# Altium project PRJ_T3.PrjPCB
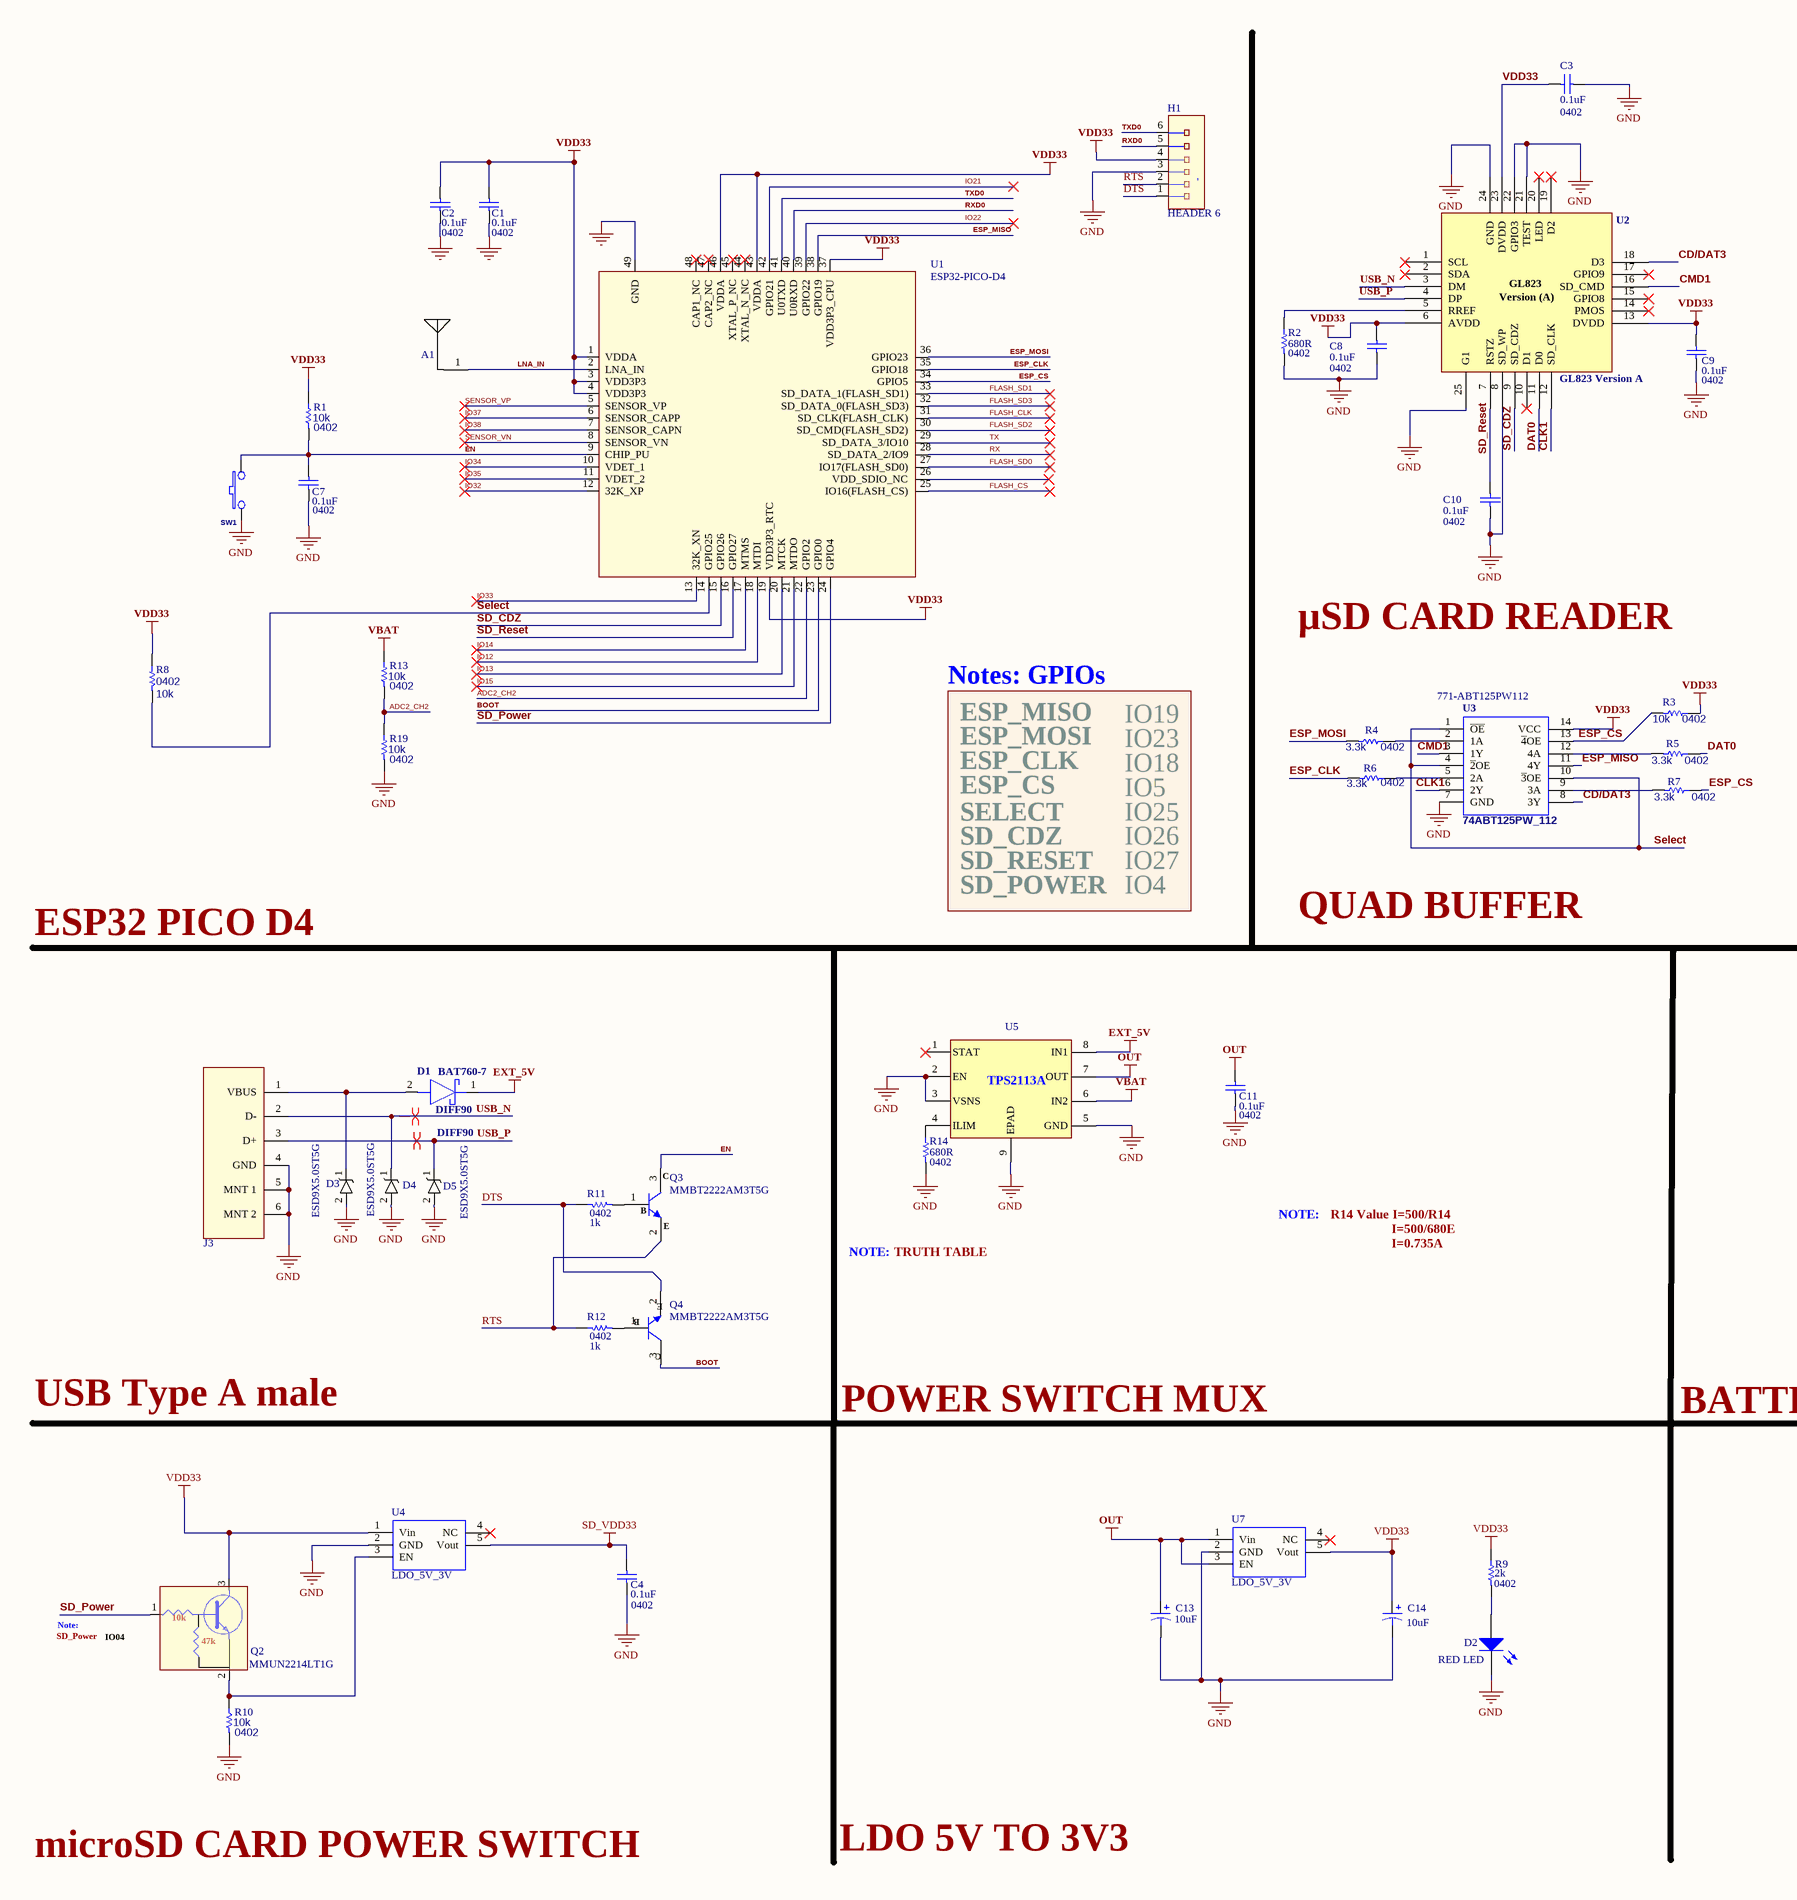
[diagram p0: PICO_D4_SD_CARD_T3.SchDoc, left]
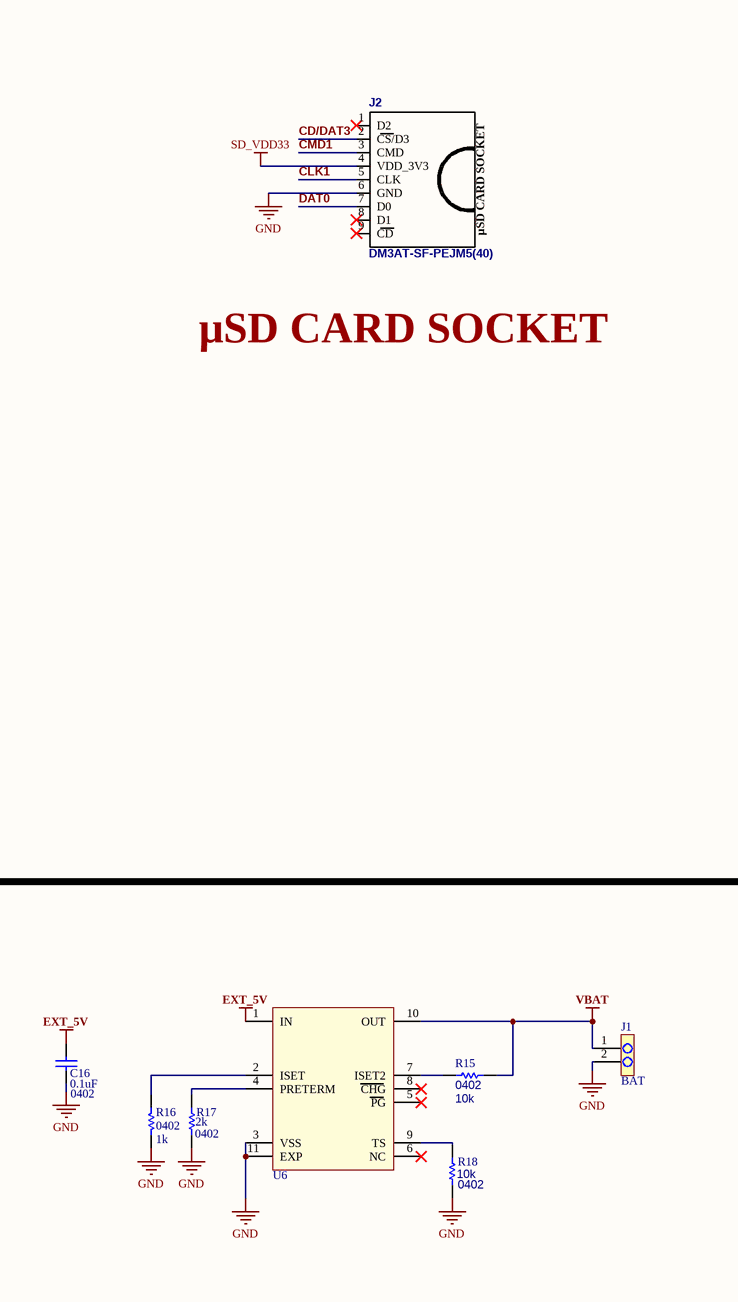
[diagram p1: PICO_D4_SD_CARD_T3.SchDoc, right]
1 sheet, 52 parts. Net scope: global (net labels, ports and power ports of the same name join across sheets).
Board files: PIC0_D4_SD_card_T3.PcbDoc, PCB_PANEL.PcbDoc

## Sheet PICO_D4_SD_CARD_T3.SchDoc
size OrCAD C

### Parts
A1  Ant  [ANT_2450AT43B100E]  (value not drawn)
C1  Case/Package: 0402  [CAPC0402]  (hidden comment: 0.1uF)
C2  Case/Package: 0402  [CAPC0402]  (hidden comment: 0.1uF)
C3  Case/Package: 0402  [CAPC0402]  (hidden comment: 0.1uF)
C4  Case/Package: 0402  [CAPC0402]  (hidden comment: 0.1uF)
C7  Case/Package: 0402  [CAPC0402]  (hidden comment: 0.1uF)
C8  Case/Package: 0402  [CAPC0402]  (hidden comment: 0.1uF)
C9  Case/Package: 0402  [CAPC0402]  (hidden comment: 0.1uF)
C10  Case/Package: 0402  [CAPC0402]  (hidden comment: 0.1uF)
C11  Case/Package: 0402  [CAPC0402]  (hidden comment: 0.1uF)
C13  10uF  [CAPC0603]
C14  10uF  [CAPC0603]
C16  Case/Package: 0402  [CAPC0402]  (hidden comment: 0.1uF)
D1  BAT760-7  [SOD2513X120N]
D2  RED LED  [LED_0603]
D3  ESD9X5.0ST5G  [SOD-923]
D4  ESD9X5.0ST5G  [SOD-923]
D5  ESD9X5.0ST5G  [SOD-923]
H1  HEADER 6  [HEADER_2MM]
J1  BAT  [HDR1X2H - duplicate]  (no BOM)
J2  DM3AT-SF-PEJM5(40)  [sd card connector]
J3  USB MALE  [Molex_48037-0001_0]  (value not drawn)
Q2  Manufacturer Part Number: MMUN2214LT1G  [SOT95P240X115-3N]  (hidden comment: Transistor NPN)
Q3  MMBT2222AM3T5G  [SOT-723]
Q4  MMBT2222AM3T5G  [SOT-723]
R1  value 10k  Case/Package: 0402  [resc0402]  (hidden comment: Res1)
R2  value 680R  Case/Package: 0402  [resc0402]
R3  value 10k  Case/Package: 0402  [resc0402]  (hidden comment: Res1)
R4  value 3.3k  Case/Package: 0402  [RESC0402]  (hidden comment: Res1)
R5  value 3.3k  Case/Package: 0402  [RESC0402]
R6  value 3.3k  Case/Package: 0402  [RESC0402]
R7  value 3.3k  Case/Package: 0402  [RESC0402]
R8  value 10k  Case/Package: 0402  [resc0402]  (hidden comment: Res1)
R9  value 2k  Case/Package: 0402  [resc0402]  (hidden comment: Res1)
R10  value 10k  Case/Package: 0402  [resc0402]  (hidden comment: Res1)
R11  value 1k  Case/Package: 0402  [resc0402]  (hidden comment: Res1)
R12  value 1k  Case/Package: 0402  [resc0402]  (hidden comment: Res1)
R13  value 10k  Case/Package: 0402  [resc0402]  (hidden comment: Res1)
R14  value 680R  Case/Package: 0402  [resc0402]
R15  value 10k  Case/Package: 0402  [resc0402]  (hidden comment: Res1)
R16  value 1k  Case/Package: 0402  [resc0402]  (hidden comment: Res1)
R17  value 2k  Case/Package: 0402  [resc0402]  (hidden comment: Res1)
R18  value 10k  Case/Package: 0402  [resc0402]  (hidden comment: Res1)
R19  value 10k  Case/Package: 0402  [resc0402]  (hidden comment: Res1)
SW1  SW PUSHBUTTON  [Micro_push]  (value not drawn)
U1  ESP32-PICO-D4  [ESP32_PICO_D4_2]
U2  GL823 Version A  [QFN24-4x4MM]
U3  74ABT125PW_112  Supplier Part Number 1: 771-ABT125PW112  [74ABT125PW]
U4  LDO_5V_3V  [SOT25]
U5  TPS2113ADRBR  [SON-8]  (value not drawn)
U6  BQ24040DSQR  [10-WFDFN]  (value not drawn)
U7  LDO_5V_3V  [SOT25]

### Nets
EXT_5V: C16.2 D1.1(K) U5.8(IN1) U6.1(IN)
GND: C1.2 C2.2 C3.1 C4.2 C7.1 C8.1 C9.1 C10.1 C11.1 C13.2 C14.2 C16.1 D2.2(K) D3.2(A) D4.2(A) D5.2(A) H1.3 J1.2 J2.6(GND) J3.4(GND) J3.5(MNT_1) J3.6(MNT_2) R2.2 R10.2 R14.2 R16.1 R17.2 R18.2 R19.2 SW1.1 U1.49(GND) U2.8(SD_WP) U2.21(TEST) U2.22(GPIO3) U2.24(GND) U2.25(G1) U3.7(GND) U4.2(GND) U5.2(EN) U5.3(VSNS) U5.5(GND) U5.9(EPAD) U6.3(VSS) U6.11(EXP) U7.2(GND)
OUT: C11.2 C13.1 U5.7(OUT) U7.1(Vin) U7.3(EN)
SD_VDD33: C4.1 J2.4(VDD_3V3) U4.5(Vout)
VBAT: J1.1 R13.1 R15.2 U5.6(IN2) U6.10(OUT)
VDD33: C1.1 C2.1 C3.2 C8.2 C9.2 C14.1 H1.4 Q2.3(C) R1.1 R3.1 R8.1 R9.1 U1.1(VDDA) U1.3(VDD3P3) U1.4(VDD3P3) U1.19(VDD3P3_RTC) U1.37(VDD3P3_CPU) U1.43(VDDA) U1.46(VDDA) U2.6(AVDD) U2.13(DVDD) U2.23(DVDD) U3.14(VCC) U4.1(Vin) U7.5(Vout)
ADC2_CH2: R13.2 R19.1 U1.22(GPIO2)
BOOT: Q4.3(C) U1.23(GPIO0)
CD/DAT3: J2.2(CS/D3) U2.18(D3) U3.8(3Y)
CLK1: J2.5(CLK) U2.12(SD_CLK) U3.6(2Y)
CMD1: J2.3(CMD) U2.16(SD_CMD) U3.3(1Y)
DAT0: J2.7(D0) R5.1 U2.11(D0)
DTS: H1.1 Q4.2(E) R11.1
EN: C7.2 Q3.3(C) R1.2 SW1.2 U1.9(CHIP_PU)
ESP_CLK: R6.2 U1.35(GPIO18)
ESP_CS: R3.2 R7.1 U1.34(GPIO5) U3.13(~{4}OE)
ESP_MISO: U1.38(GPIO19) U3.11(4Y)
ESP_MOSI: R4.2 U1.36(GPIO23)
FLASH_CLK: U1.31(SD_CLK(FLASH_CLK))
FLASH_CS: U1.25(IO16(FLASH_CS))
FLASH_SD0: U1.27(IO17(FLASH_SD0))
FLASH_SD1: U1.33(SD_DATA_1(FLASH_SD1))
FLASH_SD2: U1.30(SD_CMD(FLASH_SD2))
FLASH_SD3: U1.32(SD_DATA_0(FLASH_SD3))
IO12: U1.18(MTDI)
IO13: U1.20(MTCK)
IO14: U1.17(MTMS)
IO15: U1.21(MTDO)
IO21: U1.42(GPIO21)
IO22: U1.39(GPIO22)
IO32: U1.12(32K_XP)
IO33: U1.13(32K_XN)
IO34: U1.10(VDET_1)
IO35: U1.11(VDET_2)
IO37: U1.6(SENSOR_CAPP)
IO38: U1.7(SENSOR_CAPN)
LNA_IN: A1.1(Ant) U1.2(LNA_IN)
RTS: H1.2 Q3.2(E) R12.1
RX: U1.28(SD_DATA_2/IO9)
RXD0: H1.5 U1.40(U0RXD)
SD_CDZ: U1.15(GPIO26) U2.9(SD_CDZ)
SD_Power: Q2.1(B) U1.24(GPIO4)
SD_Reset: C10.2 U1.16(GPIO27) U2.7(RSTZ)
Select: R8.2 U1.14(GPIO25) U3.1(~{OE}) U3.4(~{2}OE) U3.10(~{3}OE)
SENSOR_VN: U1.8(SENSOR_VN)
SENSOR_VP: U1.5(SENSOR_VP)
TX: U1.29(SD_DATA_3/IO10)
TXD0: H1.6 U1.41(U0TXD)
USB_N: D4.1(K) J3.2(D-) U2.3(DM)
USB_P: D5.1(K) J3.3(D+) U2.4(DP)
NetD1_2: D1.2(A) D3.1(K) J3.1(VBUS)
NetD2_1: D2.1(A) R9.2
NetQ2_2: Q2.2(E) R10.1 U4.3(EN)
NetQ3_1: Q3.1(B) R11.2
NetQ4_1: Q4.1(B) R12.2
NetR2_1: R2.1 U2.5(RREF)
NetR4_1: R4.1 U3.2(1A)
NetR5_2: R5.2 U3.12(4A)
NetR6_1: R6.1 U3.5(2A)
NetR7_2: R7.2 U3.9(3A)
NetR14_1: R14.1 U5.4(ILIM)
NetR15_1: R15.1 U6.7(ISET2)
NetR16_2: R16.2 U6.2(ISET)
NetR17_1: R17.1 U6.4(PRETERM)
NetR18_1: R18.1 U6.9(TS)

Not connected (* = marked no-connect by the designer): J2 1(D2)* 8(D1)* 9(CD)*; U1 26(VDD_SDIO_NC)* 44(XTAL_N_NC)* 45(XTAL_P_NC)* 47(CAP2_NC)* 48(CAP1_NC)*; U2 1(SCL)* 2(SDA)* 10(D1)* 14(PMOS)* 15(GPIO8)* 17(GPIO9)* 19(D2)* 20(LED)*; U4 4(NC)*; U5 1(STAT)*; U6 5(PG)* 6(NC)* 8(CHG)*; U7 4(NC)*

### Layout directives
differential pair; net class DIFF90: USB_N, USB_P

### Notes on the sheet
- μSD CARD SOCKET
- μSD CARD READER
- Notes: GPIOs
- ESP_MISO
- ESP_MOSI
- IO19
- IO23
- ESP_CLK
- ESP_CS
- SELECT
- IO18
- IO5
- IO25
- SD_CDZ
- SD_RESET
- IO26
- IO27
- ESP32 PICO D4
- SD_POWER
- IO4
- QUAD BUFFER
- NOTE:
- R14 Value I=500/R14
- I=500/680E
- I=0.735A
- TRUTH TABLE
- USB Type A male
- POWER SWITCH MUX
- BATTERY CHARGER
- SD_Power
- Note:
- (near Q2) IO04
- microSD CARD POWER SWITCH
- LDO 5V TO 3V3
- (in symbol DM3AT-SF-PEJM5(40)) μSD CARD SOCKET
- (in symbol GL823) Version (A)
- (in symbol TPS2113ADRBR) TPS2113A
- (in symbol Transistor NPN) 10k; 47k

### Library data of the parts
A1 = Ant: High Frequency Ceramic Solutions 4-Pin SMD T/R; Manufacturer: Johanson; Manufacturer Part Number: 2450AT43B100E; Gain: -0.5dB; Impedance: 50R; Power Rating: 2W; Number of Bands: 1; Return Loss: -9.5dB; Frequency: 2.4GHz; Max Frequency: 2.5GHz; Supplier 1: Digi-Key; Supplier Part Number 1: 712-1010-1-ND; RoHS: Yes; Category: RF Antennas; Stock 1: 63050; Pricing 1: 1=0.71000, 10=0.62400, 25=0.58600, 100=0.47820, 250=0.44416, 500=0.37800 (USD); Mount: Surface Mount; Case/Package: SMD/SMT; Number of Pins: 4; Contact Plating: Tin; Package Quantity: 1; Packaging: Tape and Reel; Max Power Dissipation: 2W; Termination: Solder; Length: 7mm; Height: 0.079inch; Width: 2mm; Radiation Hardening: No; REACH SVHC: Unknown; ComponentLink1URL: https://datasheet.ciiva.com/24068/2450at43b100-242468-24068034.pdf?src-supplier=Mouser; ComponentLink1Description: https://datasheet.ciiva.com/24068/2450at43b100-242468-24068034.pdf?src-supplier=Mouser; ComponentLink2URL: https://datasheet.ciiva.com/2792/jti-antenna-2450at43b100-09042008-2792593.pdf?src-supplier=Digi-Key; ComponentLink2Description: https://datasheet.ciiva.com/2792/jti-antenna-2450at43b100-09042008-2792593.pdf?src-supplier=Digi-Key; ComponentLink3URL: https://datasheet.ciiva.com/7633/1860765-7633973.pdf?src-supplier=Element14; ComponentLink3Description: https://datasheet.ciiva.com/7633/1860765-7633973.pdf?src-supplier=Element14
C1-C4 C7-C11 C16 = Cap: Ceramic Capacitor,100nF,16V,0402; Mfr.: C0805C104K1RECAUTO; Manufacturer: TDK; Manufacturer Part Number: C1608X7R1C104K; Tolerance: 10%; Dielectric: X7R; Value: 0.1uF; Supplier 1: Digi-Key; Supplier Part Number 1: 445-1317-6-ND; Stock 1: 0; Mount: Surface Mount; Number of Pins: 2; Dielectric Material: Ceramic; Case Code (Imperial): 0402; Case Code (Metric): 1608; Min Operating Temperature: -55°C; Max Operating Temperature: 125°C; Capacitance: 100nF; Voltage Rating (DC): 16V; Packaging: Tape and Reel; Package Quantity: 1; Voltage Rating: 16V; Termination: SMD/SMT; Composition: Ceramic; Length: 1.6mm; Height: 0.8mm; Width: 0.8mm; Thickness: 0.037inch; Depth: 0.8mm; Radiation Hardening: No; Lead Free: Lead Free; ComponentLink1URL: https://media.digikey.com/pdf/Data%20Sheets/TDK%20PDFs/C_Series_GeneralAppl_Spec_rev_0.3_201012.pdf?src-supplier=Digi-Key; ComponentLink1Description: https://media.digikey.com/pdf/Data%20Sheets/TDK%20PDFs/C_Series_GeneralAppl_Spec_rev_0.3_201012.pdf?src-supplier=Digi-Key; ComponentLink2URL: https://media.digikey.com/pdf/Data%20Sheets/TDK%20PDFs/C_Series_GeneralAppl_B11.pdf?src-supplier=Digi-Key; ComponentLink2Description: https://media.digikey.com/pdf/Data%20Sheets/TDK%20PDFs/C_Series_GeneralAppl_B11.pdf?src-supplier=Digi-Key; ComponentLink3URL: https://www.verical.com/server-webapp/html/getDatasheet?partID=169336&src-supplier=Verical; ComponentLink3Description: https://www.verical.com/server-webapp/html/getDatasheet?partID=169336&src-supplier=Verical; ComponentLink4URL: http://www.tdk.co.jp/tefe02/e412_c.pdf?src-supplier=Future+Electronics; ComponentLink4Description: http://www.tdk.co.jp/tefe02/e412_c.pdf?src-supplier=Future+Electronics; ComponentLink5URL: http://www.farnell.com/datasheets/1571323.pdf?src-supplier=Element14; ComponentLink5Description: http://www.farnell.com/datasheets/1571323.pdf?src-supplier=Element14
C13 C14 = Cap Pol2: Ceramic Capacitor,10uF,16V,0603; Mfr. No: 0603C106KAT2A; Value: 10uF; Case/Package: 0603
D1 = BAT760-7: Schottky Diodes & Rectifiers 1A 30V LF1A, 2-Pin SOD-323; Manufacturer Part Number: BAT760-7; Case/Package: SOD-323
D2 = LED1: LED, RED,SMD, 0603; Case/Package: 0603; Manufacturer Part Number: LED, RED,SMD, 0603
D3-D5 = ESD9X5.0ST5G: 12.3V Clamp 8.7A (8/20µs) Ipp Tvs Diode Surface Mount SOD-923; Manufacturer: ON Semiconductor; Direction: Unidirectional; Number of Elements: 1; Capacitance: 65pF; Operating Supply Voltage: 5V; Reverse Breakdown Voltage: 6.2V; Peak Pulse Power: 107W; Power Line Protection: No; ESD Protection: Yes; Test Current: 1mA; Max Reverse Leakage Current: 1uA; Max Power Dissipation: 150mW; Element Configuration: Single; Supplier 1: Digi-Key; RoHS: Yes; Category: ESD and Circuit Protection ICs; Stock 1: 835133; Pricing 1: 1=0.14000, 10=0.12700, 25=0.12120, 100=0.05340, 250=0.05120, 500=0.04190, 1000=0.02910, 2500=0.02542 (USD); Case/Package: SOD-923-2; Number of Pins: 2; Contact Plating: Tin,Matte; Min Operating Temperature: -55°C; Max Operating Temperature: 150°C; Packaging: Tape and Reel; Package Quantity: 1; Max Surge Current: 8.7A; Number of Unidirectional Channels: 1; Reverse Standoff Voltage: 5V; Min Breakdown Voltage: 6.2V; Clamping Voltage: 12.3V; Breakdown Voltage: 6.2V; Number of Channels: 1; Polarity: Unidirectional; Termination: SMD/SMT; Working Voltage: 5V; Leakage Current: 1uA; Max Breakdown Voltage: 6.2V; Peak Pulse Current: 8.7A; Number of Lines: 1; Composition: Zener; Length: 0.8mm; Height: 0.4mm; Width: 0.65mm; Depth: 0.6mm; Radiation Hardening: No; Lead Free: Lead Free; REACH SVHC: No SVHC; Halogen Free: Halogen Free; ComponentLink1URL: https://datasheet.ciiva.com/30478/0900766b812769b5-30478676.pdf?src-supplier=RSComponents; ComponentLink1Description: https://datasheet.ciiva.com/30478/0900766b812769b5-30478676.pdf?src-supplier=RSComponents; ComponentLink2URL: https://datasheet.ciiva.com/25958/esd9x3-3st5g-d-25958458.pdf?src-supplier=Avnet+Europe; ComponentLink2Description: https://datasheet.ciiva.com/25958/esd9x3-3st5g-d-25958458.pdf?src-supplier=Avnet+Europe; ComponentLink3URL: https://datasheet.ciiva.com/1219/1748783-1219324.pdf?src-supplier=Newark; ComponentLink3Description: https://datasheet.ciiva.com/1219/1748783-1219324.pdf?src-supplier=Newark; ComponentLink4URL: https://datasheet.ciiva.com/3304/esd9x3-3st5g-d-3304012.pdf?src-supplier=Avnet; ComponentLink4Description: https://datasheet.ciiva.com/3304/esd9x3-3st5g-d-3304012.pdf?src-supplier=Avnet; ComponentLink5URL: https://datasheet.ciiva.com/339/esd9x3-3st5g-d-339709.pdf?src-supplier=Digi-Key; ComponentLink5Description: https://datasheet.ciiva.com/339/esd9x3-3st5g-d-339709.pdf?src-supplier=Digi-Key; ComponentLink6URL: https://datasheet.ciiva.com/16215/esd9x3-3st5g-d-16215149.pdf?src-supplier=Future+Electronics; ComponentLink6Description: https://datasheet.ciiva.com/16215/esd9x3-3st5g-d-16215149.pdf?src-supplier=Future+Electronics; ComponentLink7URL: https://datasheet.ciiva.com/339/esd9x3-3st5g-d-339710.pdf?src-supplier=Digi-Key; ComponentLink7Description: https://datasheet.ciiva.com/339/esd9x3-3st5g-d-339710.pdf?src-supplier=Digi-Key; ComponentLink8URL: https://datasheet.ciiva.com/339/esd9x3-3st5g-d-339711.pdf?src-supplier=Digi-Key; ComponentLink8Description: https://datasheet.ciiva.com/339/esd9x3-3st5g-d-339711.pdf?src-supplier=Digi-Key; Supplier Part Number 1: ESD9X5.0ST5GOSCT-ND; Manufacturer Part Number: ESD9X5.0ST5G
H1 = HEADER 6: Header, 6-Pin,2MM; Manufacturer Part Number: 2mm PITCH; Case/Package: TH
J1 = Header 2 pin
J2 = DM3AT-SF-PEJM5(40): Micro SD Memory Card Socket; Manufacturer_Name: Hirose; Allied_Number: R1050628; RS Part Number: 7079520P; RS Price/Stock: http://uk.rs-online.com/web/p/products/7079520P; Mouser Part Number: 798-DM3AT-SF-PEJM540; Datasheet Link: http://uk.rs-online.com/web/p/products/7079520; Manufacturer Part Number: DM3AT-SF-PEJM5(40); Allied Price/Stock: http://www.alliedelec.com/hirose-electric-dm3at-sf-pejm5-40-/R1050628/; Mouser Price/Stock: https://www.mouser.com/Search/Refine.aspx?Keyword=798-DM3AT-SF-PEJM540
J3 = USB MALE: USB A-type Plug Male PCB R/A; Manufacturer Part Number: USB Type A male; Case/Package: TH
Q2 = Transistor NPN: Bipolar Transistors - Pre-Biased 100mA 50V BRT NPN; Manufacturer: ON Semiconductor; Max Power Dissipation: 246mW; hFE Min: 80; Collector Emitter Saturation Voltage: 250mV; Element Configuration: Single; Supplier 1: Mouser; Stock 1: 56410; Pricing 1: 1=0.12, 10=0.105, 50=0.105, 100=0.037, 1000=0.025, 10000=0.017 (USD); Case/Package: SOT-23-3; Number of Pins: 3; Contact Plating: Tin,Matte; Min Operating Temperature: -55°C; Max Operating Temperature: 150°C; Package Quantity: 1; Collector Emitter Voltage (VCEO): 50V; Packaging: Tape and Reel; Max Collector Current: 100mA; Collector Emitter Breakdown Voltage: 50V; Polarity: NPN; Max Breakdown Voltage: 50V; Max Output Current: 100mA; Operating Supply Voltage: 50V; Continuous Collector Current: 100mA; Power Dissipation: 246mW; Voltage Rating (DC): 50V; Current Rating: 100mA; Length: 2.9mm; Height: 0.94mm; Width: 1.3mm; Radiation Hardening: No; Lead Free: Lead Free; Halogen Free: Halogen Free; REACH SVHC: No SVHC; ComponentLink1URL: http://www.onsemi.ru.com/pub/Collateral/DTC114Y-D.PDF?src-supplier=Avnet+Europe; ComponentLink1Description: http://www.onsemi.ru.com/pub/Collateral/DTC114Y-D.PDF?src-supplier=Avnet+Europe; ComponentLink2URL: https://www.verical.com/server-webapp/html/getDatasheet?partID=38473&src-supplier=Verical; ComponentLink2Description: https://www.verical.com/server-webapp/html/getDatasheet?partID=38473&src-supplier=Verical; ComponentLink3URL: http://www.onsemi.com/pub/Collateral/DTC114Y-D.PDF?src-supplier=Digi-Key; ComponentLink3Description: http://www.onsemi.com/pub/Collateral/DTC114Y-D.PDF?src-supplier=Digi-Key; ComponentLink4URL: http://www.onsemi.com/pub/Collateral/DTC114Y-D.PDF?src-supplier=Future+Electronics; ComponentLink4Description: http://www.onsemi.com/pub/Collateral/DTC114Y-D.PDF?src-supplier=Future+Electronics; Supplier Part Number 1: 863-MMUN2214LT1G
Q3 Q4 = MMBT2222AM3T5G: Bipolar Transistors - BJT SS SOT-723 GP TRANSISTOR NPN; Manufacturer: ON Semiconductor; Max Power Dissipation: 640mW; Collector Emitter Voltage (VCEO): 40V; Max Collector Current: 600mA; Transition Frequency: 300MHz; Collector Base Voltage (VCBO): 75V; Emitter Base Voltage (VEBO): 6V; Number of Elements: 1; Element Configuration: Single; ComponentLink1Description: Manufacturer Link; ComponentLink1URL: http://www.fairchildsemi.com/; ComponentLink2Description: Datasheet; ComponentLink2URL: http://www.fairchildsemi.com/ds/2N%2F2N3904.pdf; Supplier 1: Mouser; Supplier Part Number 1: 863-MMBT2222AM3T5G; Manufacturer Part Number: MMBT2222AM3T5G; Stock 1: 18115; Pricing 1: 1=0.2, 10=0.135, 50=0.135, 100=0.057, 1000=0.039, 2500=0.03, 8000=0.026, 10000=0.026, 24000=0.024, 48000=0.023 (USD); Case/Package: SOT-723-3; Number of Pins: 3; Contact Plating: Tin,Matte; Min Operating Temperature: -55°C; Max Operating Temperature: 150°C; Packaging: Tape and Reel; Collector Emitter Breakdown Voltage: 40V; Max Breakdown Voltage: 40V; Package Quantity: 1; Frequency: 300MHz; Polarity: NPN; Power Dissipation: 640mW; Max Frequency: 300MHz; Gain Bandwidth Product: 300MHz; Radiation Hardening: No; Lead Free: Lead Free; REACH SVHC: No SVHC; ComponentLink3URL: http://www.mouser.com/ds/2/308/MMBT2222AM3-D-107843.pdf?src-supplier=Mouser; ComponentLink3Description: http://www.mouser.com/ds/2/308/MMBT2222AM3-D-107843.pdf?src-supplier=Mouser; ComponentLink4URL: https://4donline.ihs.com/images/VipMasterIC/IC/ONSM/ONSM-S-A0003065668/ONSM-S-A0003065668-1.pdf?hkey=52A5661711E402568146F3353EA87419&src-supplier=Element14; ComponentLink4Description: https://4donline.ihs.com/images/VipMasterIC/IC/ONSM/ONSM-S-A0003065668/ONSM-S-A0003065668-1.pdf?hkey=52A5661711E402568146F3353EA87419&src-supplier=Element14; ComponentLink5URL: http://www.onsemi.com/pub/Collateral/MMBT2222AM3-D.PDF?src-supplier=Avnet; ComponentLink5Description: http://www.onsemi.com/pub/Collateral/MMBT2222AM3-D.PDF?src-supplier=Avnet; ComponentLink6URL: http://www.onsemi.com/pub/Collateral/MMBT2222AM3-D.PDF?src-supplier=Digi-Key; ComponentLink6Description: http://www.onsemi.com/pub/Collateral/MMBT2222AM3-D.PDF?src-supplier=Digi-Key; ComponentLink7URL: https://www.verical.com/server-webapp/html/getDatasheet?partID=185710&src-supplier=Verical; ComponentLink7Description: https://www.verical.com/server-webapp/html/getDatasheet?partID=185710&src-supplier=Verical; ComponentLink8URL: http://www.onsemi.com/pub/Collateral/MMBT2222AM3-D.PDF?src-supplier=Avnet+Europe; ComponentLink8Description: http://www.onsemi.com/pub/Collateral/MMBT2222AM3-D.PDF?src-supplier=Avnet+Europe; ComponentLink9URL: http://www.onsemi.com/pub_link/Collateral/MMBT2222AM3-D.PDF?src-supplier=Future+Electronics; ComponentLink9Description: http://www.onsemi.com/pub_link/Collateral/MMBT2222AM3-D.PDF?src-supplier=Future+Electronics
R1 R3 R8 R10 R13 R15 R18 R19 = Res1: Thick Film Resistor -  10Kohm, 1%, 0402; Manufacturer: Vishay; Manufacturer Part Number: CRCW040210K0FKED; Power Rating: 63mW; Temperature Coefficient: 100ppm/°C; Voltage Rating: 50V; Supplier 1: Mouser; Supplier Part Number 1: 71-CRCW0402-10K-E3; Stock 1: 7743; Pricing 1: 1=0.1, 10=0.042, 50=0.042, 100=0.029, 1000=0.016, 10000=0.011 (USD); Mount: Surface Mount; Number of Pins: 2; Weight: 2.3E-05oz; Contact Plating: Tin; Min Operating Temperature: -55°C; Max Operating Temperature: 155°C; Tolerance: 1%; Composition: Thick Film; Termination: SMD/SMT; Package Quantity: 10; Packaging: Tape and Reel; Number of Terminations: 2; Military Standard: Not; Max Power Dissipation: 63mW; Voltage Rating (DC): 50V; Features: Automotive AEC-Q200; Length: 1mm; Height: 0.35mm; Width: 0.02inch; Depth: 0.5mm; Radiation Hardening: No; Lead Free: Lead Free; REACH SVHC: Unknown; ComponentLink1URL: http://uk.rs-online.com/webdocs/0d98/0900766b80d98824.pdf?src-supplier=RSComponents; ComponentLink1Description: http://uk.rs-online.com/webdocs/0d98/0900766b80d98824.pdf?src-supplier=RSComponents; ComponentLink2URL: http://www.vishay.com/docs/20035/dcrcwe3.pdf?src-supplier=Digi-Key; ComponentLink2Description: http://www.vishay.com/docs/20035/dcrcwe3.pdf?src-supplier=Digi-Key; ComponentLink3URL: http://www.farnell.com/datasheets/2045673.pdf?src-supplier=Element14; ComponentLink3Description: http://www.farnell.com/datasheets/2045673.pdf?src-supplier=Element14; ComponentLink4URL: http://www.vishay.com/docs/20035/dcrcwe3.pdf?src-supplier=Avnet; ComponentLink4Description: http://www.vishay.com/docs/20035/dcrcwe3.pdf?src-supplier=Avnet; ComponentLink5URL: https://www.distrelec.biz/Web/Downloads/a_/en/flD-CRCW-e3_data_en.pdf?mime=application%2Fpdf&src-supplier=Distrelec; ComponentLink5Description: https://www.distrelec.biz/Web/Downloads/a_/en/flD-CRCW-e3_data_en.pdf?mime=application%2Fpdf&src-supplier=Distrelec; ComponentLink6URL: http://www.vishay.com/docs/20035/dcrcwe3.pdf?src-supplier=Mouser; ComponentLink6Description: http://www.vishay.com/docs/20035/dcrcwe3.pdf?src-supplier=Mouser; ComponentLink7URL: http://www.farnell.com/datasheets/2111203.pdf?src-supplier=Element14; ComponentLink7Description: http://www.farnell.com/datasheets/2111203.pdf?src-supplier=Element14; ComponentLink8URL: http://www.vishay.com/docs/20035/dcrcwe3.pdf?src-supplier=Future+Electronics; ComponentLink8Description: http://www.vishay.com/docs/20035/dcrcwe3.pdf?src-supplier=Future+Electronics
  R1 R3 R8: Case Code (Metric): 1005; Case Code (Imperial): 0402
R2 R14 = Res1: Thick Film Resistor - 680 ohm, 1%, 0402; Manufacturer: Panasonic; Manufacturer Part Number: ERA-2AEB681X; Tolerance: 0.1%; Temperature Coefficient: 25ppm/°C; Power Rating: 63mW; Voltage Rating: 25V; ComponentLink1URL: http://www.farnell.com/datasheets/1678796.pdf?src-supplier=Element14; ComponentLink1Description: http://www.farnell.com/datasheets/1678796.pdf?src-supplier=Element14; ComponentLink2URL: http://www.farnell.com/datasheets/2059623.pdf?src-supplier=Element14; ComponentLink2Description: http://www.farnell.com/datasheets/2059623.pdf?src-supplier=Element14; ComponentLink3URL: http://industrial.panasonic.com/www-cgi/jvcr13pz.cgi?E+PZ+3+AOA0002+ERJ1GNJ120C+7+WW?src-supplier=Mouser; ComponentLink3Description: http://industrial.panasonic.com/www-cgi/jvcr13pz.cgi?E+PZ+3+AOA0002+ERJ1GNJ120C+7+WW?src-supplier=Mouser; ComponentLink4URL: http://industrial.panasonic.com/www-data/pdf/AOA0000/AOA0000CE1.pdf?src-supplier=Avnet+Europe; ComponentLink4Description: http://industrial.panasonic.com/www-data/pdf/AOA0000/AOA0000CE1.pdf?src-supplier=Avnet+Europe; ComponentLink5URL: http://www.jameco.com/Jameco/Products/ProdDS/2007265.pdf?src-supplier=Jameco; ComponentLink5Description: http://www.jameco.com/Jameco/Products/ProdDS/2007265.pdf?src-supplier=Jameco; ComponentLink6URL: http://industrial.panasonic.com/www-data/pdf/AOA0000/AOA0000CE1.pdf?src-supplier=Avnet; ComponentLink6Description: http://industrial.panasonic.com/www-data/pdf/AOA0000/AOA0000CE1.pdf?src-supplier=Avnet; ComponentLink7URL: https://industrial.panasonic.com/cdbs/www-data/pdf/RDA0000/AOA0000C301.pdf?src-supplier=Future+Electronics; ComponentLink7Description: https://industrial.panasonic.com/cdbs/www-data/pdf/RDA0000/AOA0000C301.pdf?src-supplier=Future+Electronics; Supplier 1: Mouser; Supplier Part Number 1: 667-ERA-2AEB681X; Stock 1: 13785; Pricing 1: 1=0.59, 10=0.585, 50=0.585, 100=0.162, 1000=0.104, 10000=0.057 (USD); Mount: Surface Mount; Number of Pins: 2; Contact Plating: Tin; Case Code (Metric): 1005; Case Code (Imperial): 0402; Min Operating Temperature: -55°C; Max Operating Temperature: 155°C; Composition: Thin Film,Metal Film; Packaging: Tape and Reel; Package Quantity: 1; Number of Terminations: 2; Termination: SMD/SMT; Military Standard: Not; Max Power Dissipation: 63mW; Voltage Rating (DC): 25V; Features: Automotive AEC-Q200; Length: 1mm; Height: 0.35mm; Width: 0.02inch; Depth: 0.5mm; Radiation Hardening: No; REACH SVHC: No SVHC; Lead Free: Lead Free; ComponentLink8URL: http://www.mouser.com/ds/2/315/AOA0000CE26-197354.pdf?src-supplier=Mouser; ComponentLink8Description: http://www.mouser.com/ds/2/315/AOA0000CE26-197354.pdf?src-supplier=Mouser; ComponentLink9URL: http://www.farnell.com/datasheets/328837.pdf?src-supplier=Element14; ComponentLink9Description: http://www.farnell.com/datasheets/328837.pdf?src-supplier=Element14; ComponentLink10URL: http://uk.rs-online.com/webdocs/0bee/0900766b80beefcc.pdf?src-supplier=RSComponents; ComponentLink10Description: http://uk.rs-online.com/webdocs/0bee/0900766b80beefcc.pdf?src-supplier=RSComponents; ComponentLink11URL: http://industrial.panasonic.com/www-data/pdf/AOA0000/AOA0000CE26.pdf?src-supplier=Avnet+Europe; ComponentLink11Description: http://industrial.panasonic.com/www-data/pdf/AOA0000/AOA0000CE26.pdf?src-supplier=Avnet+Europe
R4-R7 = Res1: Thick Film Resistor - 3.3 Kohm, 1%, 0402; Manufacturer: Vishay Dale; Manufacturer Part Number: CRCW04023K30JNED; Tolerance: 5%; Power Rating: 63mW; Voltage Rating: 50V; Temperature Coefficient: 200ppm/°C; Supplier 1: Arrow; Supplier Part Number 1: CRCW04023K30JNED; Stock 1: 0; Number of Pins: 2; Weight: 2.3E-05oz; Contact Plating: Tin; Min Operating Temperature: -55°C; Max Operating Temperature: 155°C; Packaging: Tape and Reel; Package Quantity: 1; Composition: Thick Film; Number of Terminations: 2; Military Standard: Not; Termination: SMD/SMT; Max Power Dissipation: 63mW; Voltage Rating (DC): 50V; Features: Automotive AEC-Q200; Length: 1mm; Height: 0.35mm; Width: 0.5mm; Depth: 0.5mm; Radiation Hardening: No; REACH SVHC: Unknown; Lead Free: Lead Free; ComponentLink1URL: https://www.verical.com/server-webapp/html/getDatasheet?partID=33137&src-supplier=Verical; ComponentLink1Description: https://www.verical.com/server-webapp/html/getDatasheet?partID=33137&src-supplier=Verical; ComponentLink2URL: http://www.vishay.com/docs/20035/dcrcwe3.pdf?src-supplier=Avnet; ComponentLink2Description: http://www.vishay.com/docs/20035/dcrcwe3.pdf?src-supplier=Avnet; ComponentLink3URL: https://www.alliedelec.com/m/d/0c934d6939ccefa68dbe0b96d821c8cf.pdf?src-supplier=Allied+Electronics; ComponentLink3Description: https://www.alliedelec.com/m/d/0c934d6939ccefa68dbe0b96d821c8cf.pdf?src-supplier=Allied+Electronics; ComponentLink4URL: http://www.vishay.com/docs/20035/dcrcwe3.pdf?src-supplier=Digi-Key; ComponentLink4Description: http://www.vishay.com/docs/20035/dcrcwe3.pdf?src-supplier=Digi-Key
R9 R17 = Res1: Thick Film Resistor -  2Kohm, 1%, 0402; Manufacturer: Vishay Semiconductors; Manufacturer Part Number: CRCW04022K00FKEDC; Temperature Coefficient: 100ppm/°C; Power Rating: 62.5mW; Supplier 1: Mouser; Supplier Part Number 1: 71-CRCW04022K00FKEDC; Stock 1: 219981; Pricing 1: 1=0.12, 10=0.05, 50=0.05, 100=0.026, 1000=0.014, 10000=0.008 (USD); Mount: Surface Mount; Contact Plating: Tin; Min Operating Temperature: -55°C; Max Operating Temperature: 155°C; Composition: Thick Film; Tolerance: 1%; Termination: Wraparound; Length: 1mm; Lead Free: Lead Free
R11 R12 R16 = Res1: Thick Film Resistor -  1Kohm, 1%, 0402; Manufacturer: TE Connectivity; Manufacturer Part Number: CRGCQ0402F1K0; Max Power Dissipation: 63mW; Temperature Coefficient: 100ppm/°C; ComponentLink1URL: http://uk.rs-online.com/webdocs/0d98/0900766b80d98824.pdf?src-supplier=RSComponents; ComponentLink1Description: http://uk.rs-online.com/webdocs/0d98/0900766b80d98824.pdf?src-supplier=RSComponents; ComponentLink2URL: http://www.vishay.com/docs/20035/dcrcwe3.pdf?src-supplier=Digi-Key; ComponentLink2Description: http://www.vishay.com/docs/20035/dcrcwe3.pdf?src-supplier=Digi-Key; ComponentLink3URL: http://www.farnell.com/datasheets/2045673.pdf?src-supplier=Element14; ComponentLink3Description: http://www.farnell.com/datasheets/2045673.pdf?src-supplier=Element14; ComponentLink4URL: http://www.vishay.com/docs/20035/dcrcwe3.pdf?src-supplier=Avnet; ComponentLink4Description: http://www.vishay.com/docs/20035/dcrcwe3.pdf?src-supplier=Avnet; ComponentLink5URL: https://www.distrelec.biz/Web/Downloads/a_/en/flD-CRCW-e3_data_en.pdf?mime=application%2Fpdf&src-supplier=Distrelec; ComponentLink5Description: https://www.distrelec.biz/Web/Downloads/a_/en/flD-CRCW-e3_data_en.pdf?mime=application%2Fpdf&src-supplier=Distrelec; ComponentLink6URL: http://www.vishay.com/docs/20035/dcrcwe3.pdf?src-supplier=Mouser; ComponentLink6Description: http://www.vishay.com/docs/20035/dcrcwe3.pdf?src-supplier=Mouser; ComponentLink7URL: http://www.farnell.com/datasheets/2111203.pdf?src-supplier=Element14; ComponentLink7Description: http://www.farnell.com/datasheets/2111203.pdf?src-supplier=Element14; ComponentLink8URL: http://www.vishay.com/docs/20035/dcrcwe3.pdf?src-supplier=Future+Electronics; ComponentLink8Description: http://www.vishay.com/docs/20035/dcrcwe3.pdf?src-supplier=Future+Electronics; Supplier 1: Mouser; Supplier Part Number 1: 279-CRGCQ0402F1K0; Stock 1: 134807; Pricing 1: 1=0.1, 10=0.022, 50=0.022, 100=0.009, 1000=0.004, 10000=0.002 (USD); Case Code (Imperial): 0402; Case Code (Metric): 1005; Min Operating Temperature: -55°C; Max Operating Temperature: 155°C; Composition: Thick Film; Features: Moisture Resistant,Automotive AEC-Q200; Packaging: Tape and Reel; Tolerance: 1%; Number of Terminations: 2; ComponentLink9URL: https://www.te.com/commerce/DocumentDelivery/DDEController?Action=srchrtrv&amp;DocNm=1773204-3&amp;DocType=DS&amp;DocLang=English&src-supplier=Digi-Key; ComponentLink9Description: https://www.te.com/commerce/DocumentDelivery/DDEController?Action=srchrtrv&amp;DocNm=1773204-3&amp;DocType=DS&amp;DocLang=English&src-supplier=Digi-Key; ComponentLink10URL: https://4donline.ihs.com/images/VipMasterIC/IC/TYEL/TYEL-S-A0004929575/TYEL-S-A0004929575-1.pdf?hkey=52A5661711E402568146F3353EA87419&src-supplier=Farnell; ComponentLink10Description: https://4donline.ihs.com/images/VipMasterIC/IC/TYEL/TYEL-S-A0004929575/TYEL-S-A0004929575-1.pdf?hkey=52A5661711E402568146F3353EA87419&src-supplier=Farnell; ComponentLink11URL: https://4donline.ihs.com/images/VipMasterIC/IC/TYEL/TYEL-S-A0004929575/TYEL-S-A0004929575-1.pdf?hkey=52A5661711E402568146F3353EA87419&src-supplier=Newark; ComponentLink11Description: https://4donline.ihs.com/images/VipMasterIC/IC/TYEL/TYEL-S-A0004929575/TYEL-S-A0004929575-1.pdf?hkey=52A5661711E402568146F3353EA87419&src-supplier=Newark
SW1 = SW PUSHBUTTON: Tactile Switch 3x4x2mm SMD 2-Pin; Manufacturer Part Number: 3x4x2mm switch; Case/Package: SMD
U1 = ESP8080_1: RF System on a Chip - SoC SIP module ESP32 with 4MByte Flash; Manufacturer Part Number: ESP32-PICO-D4; Case/Package: QFN-48
U2 = GL823: USB 2.0 SD/MMC Card Reader Controller version A; Manufacturer Part Number: GL823 VERSION A; Case/Package: QFN24; Value: -
U3 = 74ABT125PW_112: Buffers & Line Drivers QUAD BUFFER 3-S; Manufacturer: NXP Semiconductors; Manufacturer Part Number: 74ABT125PW,112; Logic Function: Buffer,Inverting; Number of Channels: 4; Max Supply Voltage: 5.5V; Min Supply Voltage: 4.5V; Operating Supply Voltage: 5V; Propagation Delay: 4.6ns; Number of Bits per Element: 1; High Level Output Current: -32mA; Low Level Output Current: 64mA; Polarity: Non-Inverting; Turn-On Delay Time: 6.8ns; Supplier 1: Mouser; Stock 1: 2194; Pricing 1: 1=0.57, 10=0.472, 50=0.472, 100=0.304, 1000=0.244, 2500=0.206, 10000=0.198, 25000=0.19, 50000=0.187, 100000=0.183 (USD); Mount: Surface Mount; Case/Package: TSSOP-14; Number of Pins: 14; Contact Plating: Gold; Min Operating Temperature: -40°C; Max Operating Temperature: 85°C; Packaging: Rail/Tube; Number of Inputs: 4; Number of Outputs: 4; Package Quantity: 2400; Number of Elements: 4; Number of Input Lines: 4; Number of Output Lines: 4; Radiation Hardening: No; Lead Free: Lead Free; ComponentLink1URL: https://www.verical.com/server-webapp/html/getDatasheet?partID=194630&src-supplier=Verical; ComponentLink1Description: https://www.verical.com/server-webapp/html/getDatasheet?partID=194630&src-supplier=Verical; ComponentLink2URL: http://www.nxp.com/documents/data_sheet/74ABT125.pdf?src-supplier=Future+Electronics; ComponentLink2Description: http://www.nxp.com/documents/data_sheet/74ABT125.pdf?src-supplier=Future+Electronics
U4 U7 = LDO_5V_3V: LDO Voltage Regulators 600mA CMOS LDO 50mA 3.3V 250mV; Manufacturer: Diodes; Manufacturer Part Number: AP2112K-3.3TRG1; Value: LDO 5-3.3; Number of Outputs: 1; Max Input Voltage: 6V; Quiescent Current: 55uA; Polarity: Positive; Accuracy: 1.5%; Output Type: Fixed; Supplier 1: Future Electronics; Supplier Part Number 1: 2098204; Stock 1: 0; Mount: Surface Mount; Case/Package: SOT-23-5; Number of Pins: 5; Min Operating Temperature: -40°C; Max Operating Temperature: 85°C; Package Quantity: 1; Packaging: Tape and Reel; Dropout Voltage: 250mV; Output Voltage: 3.3V; Output Current: 600mA; Number of Regulators: 1; Max Output Current: 600mA; Length: 3.1mm; Height: 1.3mm; Width: 1.7mm; Lead Free: Lead Free; ComponentLink1URL: http://www.diodes.com/datasheets/AP2112.pdf?src-supplier=Avnet; ComponentLink1Description: http://www.diodes.com/datasheets/AP2112.pdf?src-supplier=Avnet; ComponentLink2URL: https://www.diodes.com/assets/Datasheets/AP2112.pdf?src-supplier=Digi-Key; ComponentLink2Description: https://www.diodes.com/assets/Datasheets/AP2112.pdf?src-supplier=Digi-Key
U5 = TPS2113ADRBR: Power Switch ICs -Autoswitching Pwr Mux 3-mm × 3-mm SON-8; Manufacturer: Texas Instruments; Number of Inputs: 2; Number of Outputs: 1; Output Current: 1.25A; Max Input Voltage: 5.5V; Min Input Voltage: 2.8V; Turn-On Delay Time: 1ms; Supplier 1: Digi-Key; Manufacturer Part Number: TPS2113ADRBR; RoHS: Yes; Category: Integrated Circuits (ICs); Stock 1: 3232; Pricing 1: 1=1.95000, 10=1.74900, 25=1.65000, 100=1.32000, 250=1.15500, 500=1.12200, 1000=0.89100 (USD); Case/Package: SON-8 (3X3); Number of Pins: 8; Min Operating Temperature: -40°C; Max Operating Temperature: 85°C; Packaging: Tape and Reel; Package Quantity: 3000; Max Output Current: 1.25A; Current - Output 2: 1.25A; Operating Supply Voltage: 5.5V; Radiation Hardening: No; Lead Free: Lead Free; ComponentLink1URL: https://datasheet.ciiva.com/15109/getdatasheetpartid-627486-15109322.pdf?src-supplier=Verical; ComponentLink1Description: https://datasheet.ciiva.com/15109/getdatasheetpartid-627486-15109322.pdf?src-supplier=Verical; ComponentLink2URL: https://datasheet.ciiva.com/3232/tps2112a-3232522.pdf?src-supplier=Avnet; ComponentLink2Description: https://datasheet.ciiva.com/3232/tps2112a-3232522.pdf?src-supplier=Avnet; ComponentLink3URL: https://datasheet.ciiva.com/1961/tps2113a-1961004.pdf?src-supplier=Digi-Key; ComponentLink3Description: https://datasheet.ciiva.com/1961/tps2113a-1961004.pdf?src-supplier=Digi-Key; Supplier Part Number 1: 296-46373-1-ND
U6 = BQ24040DSQR: IC BATT CHG LI-ION 1 CELL 10SON; Manufacturer: Texas Instruments; Output Current: 800mA; Max Power Dissipation: 1.66W; Output Voltage: 4.2V; Min Supply Voltage: 4.75V; Max Supply Voltage: 28V; Min Input Voltage: 3.5V; Number of Cells: 1; Operating Supply Current: 800uA; Max Charge Current: 1A; Fault Protection: Over Voltage,Over Temperature,Short Circuit; Supplier 1: Digi-Key; Manufacturer Part Number: BQ24040DSQR; Stock 1: 20950; Pricing 1: 1=1.26, 10=1.124, 25=1.0672, 100=0.8194, 250=0.7241, 500=0.686, 1000=0.5335 (USD); Number of Pins: 10; Case/Package: WSON-10; Min Operating Temperature: -40°C; Max Operating Temperature: 85°C; Packaging: Tape and Reel; Package Quantity: 3000; Battery Pack Voltage: 4.2V; REACH SVHC: No SVHC; Lead Free: Lead Free; ComponentLink1URL: http://www.ti.com/lit/pdf/slyt420?src-supplier=Digi-Key; ComponentLink1Description: http://www.ti.com/lit/pdf/slyt420?src-supplier=Digi-Key; ComponentLink2URL: http://www.ti.com/general/docs/suppproductinfo.tsp?distId=10&gotoUrl=http%3A%2F%2Fwww.ti.com%2Flit%2Fgpn%2Fbq24040&src-supplier=Digi-Key; ComponentLink2Description: http://www.ti.com/general/docs/suppproductinfo.tsp?distId=10&gotoUrl=http%3A%2F%2Fwww.ti.com%2Flit%2Fgpn%2Fbq24040&src-supplier=Digi-Key; ComponentLink3URL: http://datasheet.iiic.cc/texas_instruments/BQ24040DSQR.pdf?src-supplier=IIIC; ComponentLink3Description: http://datasheet.iiic.cc/texas_instruments/BQ24040DSQR.pdf?src-supplier=IIIC; Supplier Part Number 1: 296-37142-1-ND